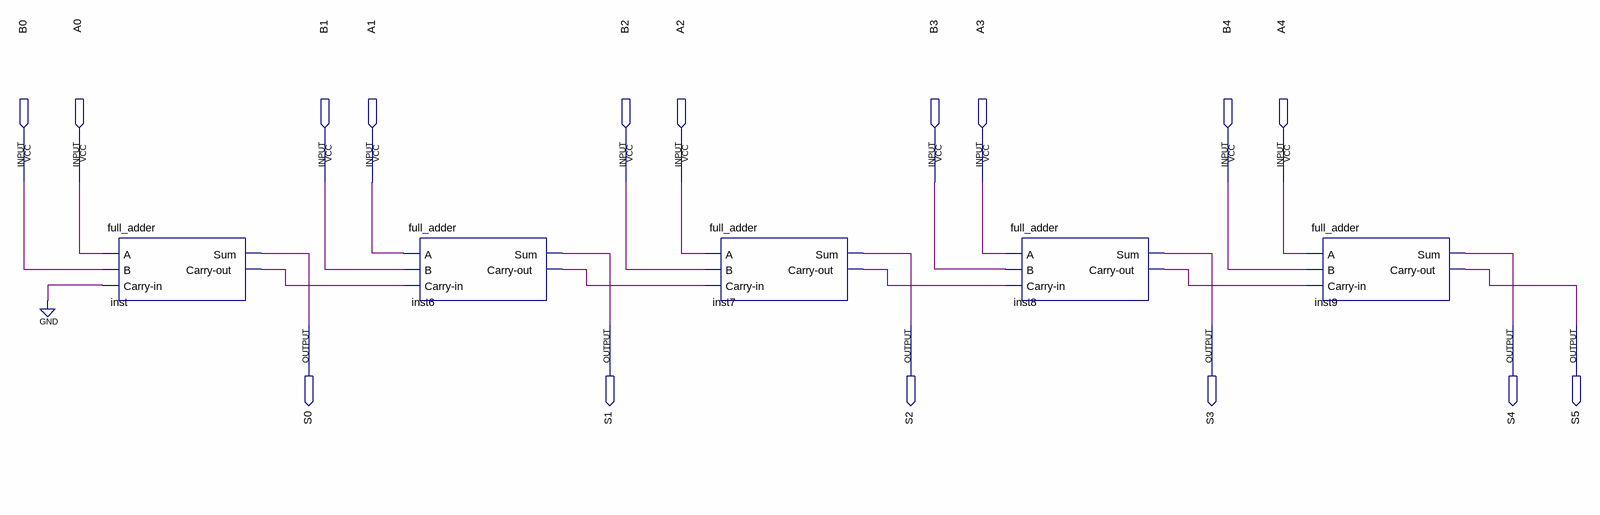
[diagram p0: schematic sheet]
// Quartus schematic five_bit_adder.bdf as structural Verilog: 5 symbols, 16 pins
module five_bit_adder (
  input  B0,
  input  A0,
  input  B1,
  input  A1,
  input  B2,
  input  A2,
  input  B3,
  input  A3,
  input  B4,
  input  A4,
  output S0,
  output S1,
  output S2,
  output S3,
  output S4,
  output S5
);

  wire inst6_carry_out, inst7_carry_out, inst8_carry_out, inst_carry_out;

  full_adder inst (.A(A0), .B(B0), .\Carry-in (1'b0), .Sum(S0), .\Carry-out (inst_carry_out));
  full_adder inst6 (.A(A1), .B(B1), .\Carry-in (inst_carry_out), .Sum(S1), .\Carry-out (inst6_carry_out));
  full_adder inst7 (.A(A2), .B(B2), .\Carry-in (inst6_carry_out), .Sum(S2), .\Carry-out (inst7_carry_out));
  full_adder inst8 (.A(A3), .B(B3), .\Carry-in (inst7_carry_out), .Sum(S3), .\Carry-out (inst8_carry_out));
  full_adder inst9 (.A(A4), .B(B4), .\Carry-in (inst8_carry_out), .Sum(S4), .\Carry-out (S5));
endmodule
